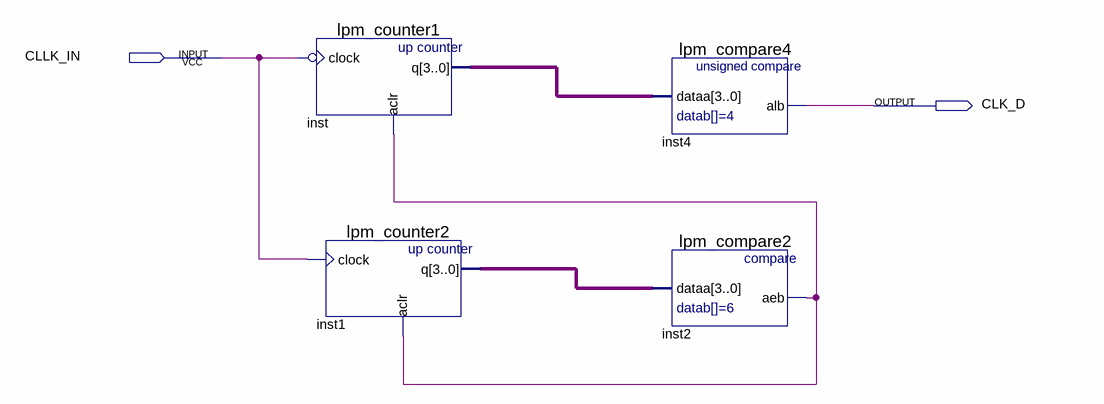
[diagram p0: schematic sheet]
// Quartus schematic Block2.bdf as structural Verilog: 4 symbols, 2 pins
module Block2 (
  input  CLLK_IN,
  output CLK_D
);

  wire inst2_aeb;
  wire [3:0] inst1_q, inst_q;

  lpm_counter1 inst (.clock(~CLLK_IN), .aclr(inst2_aeb), .q(inst_q));
  lpm_counter2 inst1 (.clock(CLLK_IN), .aclr(inst2_aeb), .q(inst1_q));
  lpm_compare4 inst4 (.dataa(inst_q), .alb(CLK_D));
  lpm_compare2 inst2 (.dataa(inst1_q), .aeb(inst2_aeb));
endmodule
